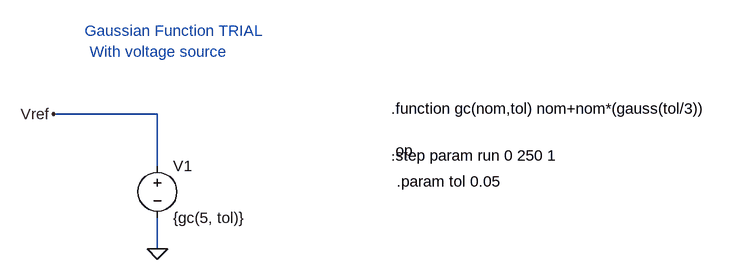
[diagram p0: schematic Draft23.asc]
Draft23.asc, the LTspice schematic file:
Version 4.1
SHEET 1 1288 680
WIRE 320 144 160 144
WIRE 320 224 320 144
WIRE 320 352 320 304
FLAG 320 352 0
FLAG 160 144 Vref
SYMBOL voltage 320 208 R0
SYMATTR InstName V1
SYMATTR Value {gc(5, tol)}
TEXT 208 16 Left 2 ;Gaussian Function TRIAL
TEXT 216 48 Left 2 ;With voltage source
TEXT 680 136 Left 2 !.function gc(nom,tol) nom+nom*(gauss(tol/3))
TEXT 680 208 Left 2 !.step param run 0 250 1
TEXT 688 248 Left 2 !.param tol 0.05
TEXT 680 200 Left 2 !.op

The netlist it stands for:
* Draft23.asc
V1 Vref 0 {gc(5, tol)}
* Gaussian Function TRIAL
* With voltage source
.function gc(nom,tol) nom+nom*(gauss(tol/3))
.step param run 0 250 1
.param tol 0.05
.op
.backanno
.end